# EasyEDA Pro project RC Receiver.epro

# Schematic Schematic
Board Name: Receiver; Create Date: 2025-03-04; Page Name: P1; Project Name: RC Receiver; Schematic Name: Schematic; Update Date: 2025-03-05; Company: MUS; Page Size: A4; Version: V1.0
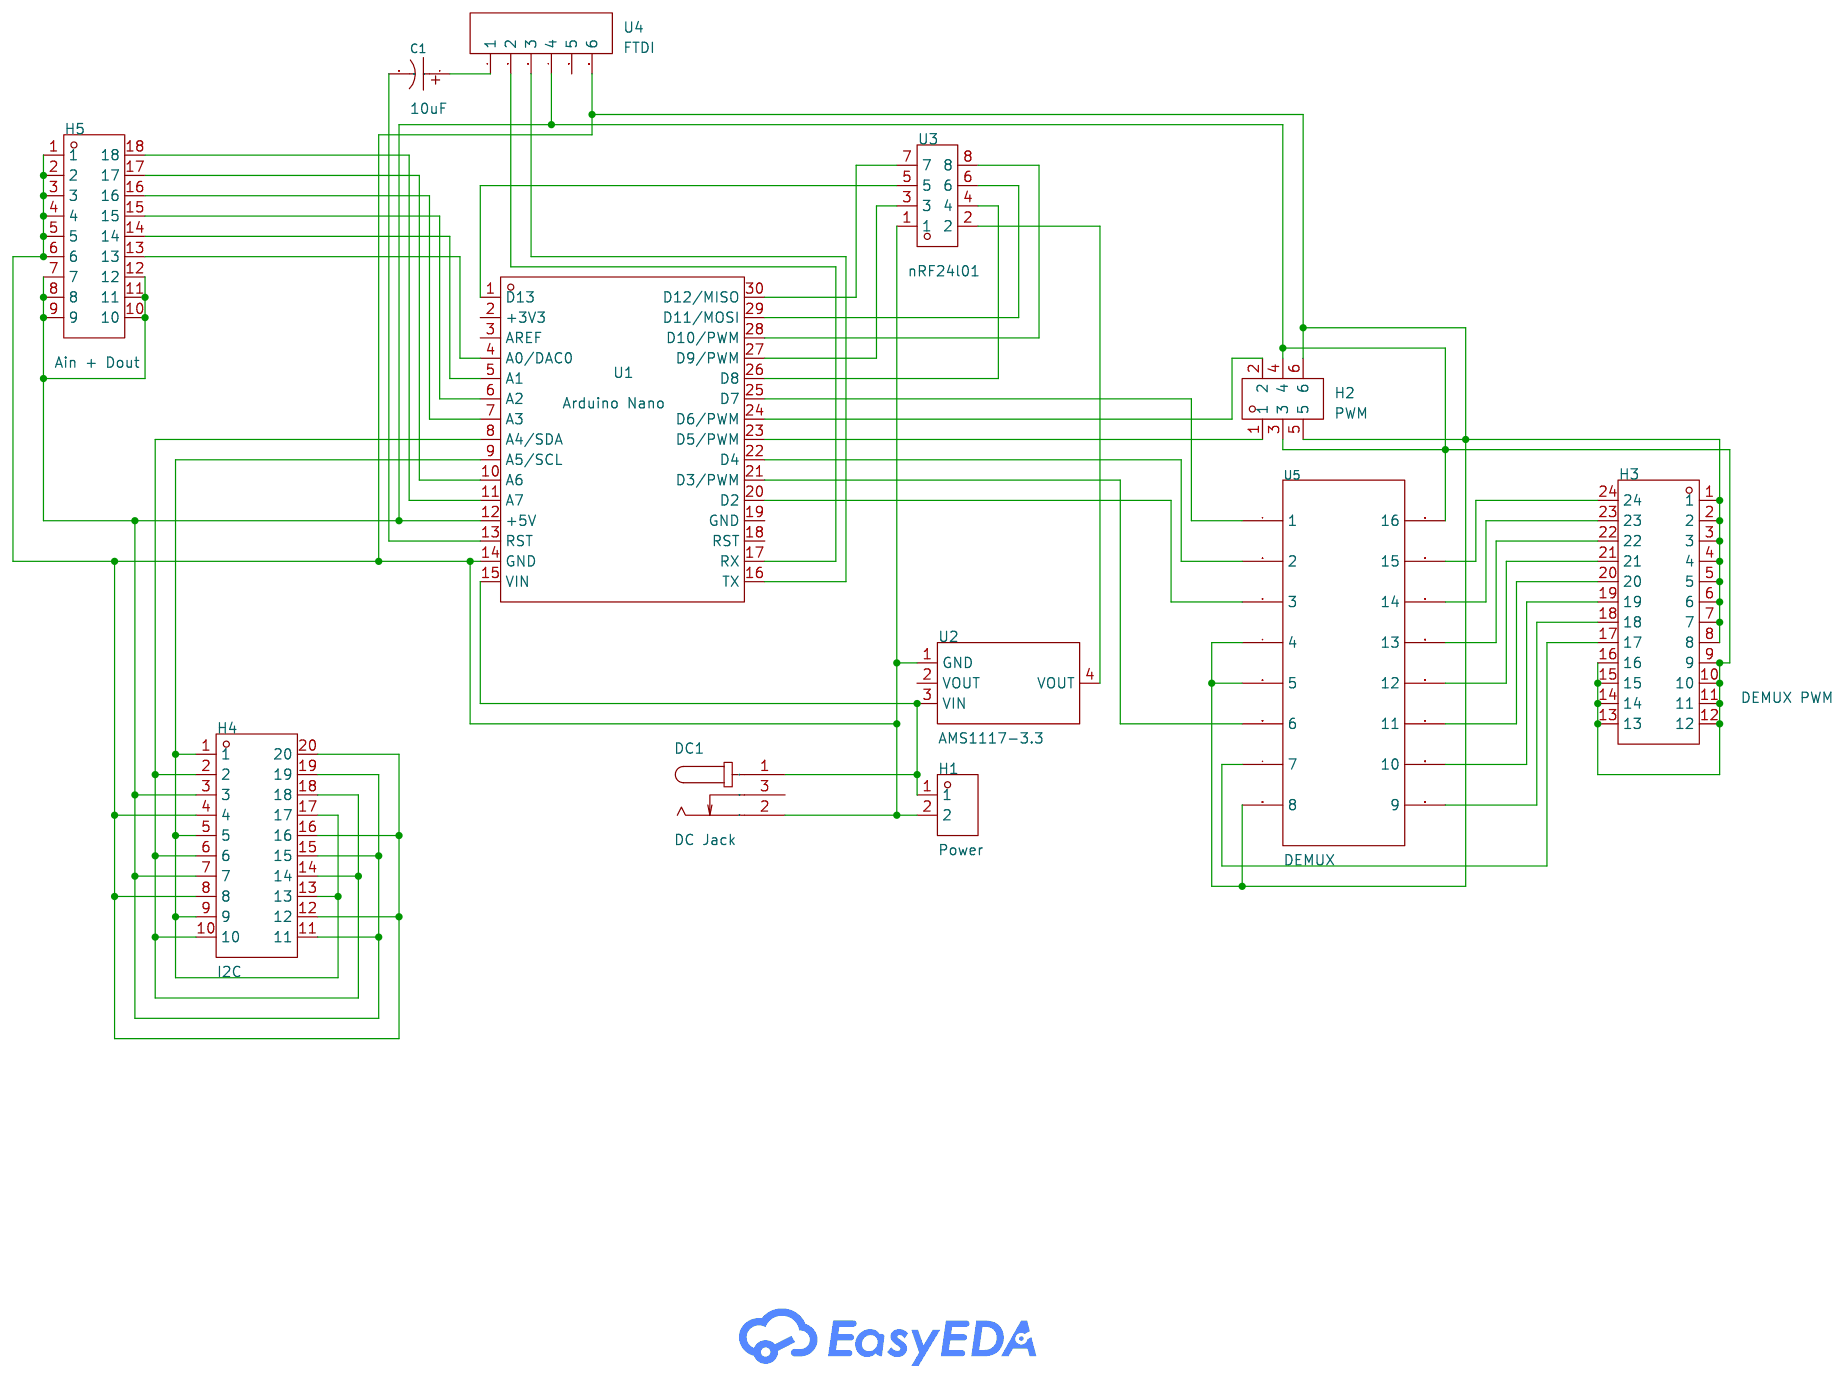
[diagram p0: schematic sheet]

## Parts
C1  10uF  [CAP-TH_BD5.0-P2.00-D0.8-FD]
DC1  DC Jack  [DC-IN-TH_DC-005-5A-2.0]
H1  Power  [HDR-TH_2P-P2.54-V-M_5]
H2  PWM  [HDR-TH_6P-P2.54-V-M-R2-C3-S2.54]
H3  DEMUX PWM  [HDR-TH_24P-P2.54-V-M-R3-C8-S2.54_1]
H4  I2C  [HDR-TH_20P-P2.54-V-M-R4-C5-S2.54]
H5  Ain + Dout  [CONN-TH_HX-PZ2.54-3X6P-ZZ]
U1  Arduino Nano  [MOD-TH_ABX00028]
U2  AMS1117-3.3  [SOT-223-3_L6.5-W3.4-P2.30-LS7.0-BR]
U3  nRF24l01  [HDR-TH_8P-P2.54-V-F-R2-C4-S2.54]
U4  FTDI  [HDR-TH_6P-P2.54-V-M-1]
U5  DEMUX  [DIP-16_L20.3-W10.2-P2.54-LS7.6-BL-2]

## Library data of the parts
C1 = RD1H106M05011PC: Capacitance: Tolerance:±20% Tolerance:±20% Rated Voltage: Ripple Current:- Equivalent Series Resistance(ESR):- Lead Spacing: φD: L: Lifetime @ Temp:1000hrs@105℃; LCSC Part Name: 10uF ±20% 50V; Supplier Part: C160624; Manufacturer: SAMWHA(三和); Supplier Footprint: 插件,D5xL11mm; JLCPCB Part Class: Extended Part; Datasheet: https://atta.szlcsc.com/upload/public/pdf/source/20171212/C160624_15130639695151177990.pdf; Supplier: LCSC; Tolerance: ±20%; Lifetime @ Temp: 1000hrs@105℃
DC1 = DC-005-5A-2.0: Connector Type:DC Power Receptacle Mounting Style:Bend insert Inside Contact Diameter:2mm Outside Contact Diameter:6.2mm Current Rating (Max):5A Voltage Rating (Max):24V Operating Temperature Range:-20℃~+70℃ Operating Temperature Range:-20℃~+70℃; LCSC Part Name: DC电源插座 内径:2mm 外径:6.2mm; Supplier Part: C381116; Manufacturer: XKB Connection(中国星坤); Supplier Footprint: 插件; JLCPCB Part Class: Extended Part; Datasheet: https://atta.szlcsc.com/upload/public/pdf/source/20211015/707A35F7AB6E89C57AAB641950105BB7.pdf; Supplier: LCSC; Connector Type: DC Power Receptacle; Mounting Style: Bend insert; Inside Contact Diameter: 2mm; Outside Contact Diameter: 6.2mm; Current Rating (Max): 5A; Voltage Rating (Max): 24V; Operating Temperature Range: -20℃~+70℃
H1 = PZ254-1-02-Z-C: Pin Structure:1x2P Pitch:2.54mm Row Spacing:- Circluar Pins/Square Pins:Circular Pins Mounting Type:Straight Number of Rows:Plugin Number of Pins:2P Current Rating (Max):3A Length of Mating Pin:4.13mm Insulation Height:3mm Length of End Connection Pin:3mm; LCSC Part Name: 1x2P 间距:2.54mm 圆针 直插; Supplier Part: C5156429; Manufacturer: HCTL(华灿天禄); Supplier Footprint: 插件,P=2.54mm; JLCPCB Part Class: Extended Part; Datasheet: https://atta.szlcsc.com/upload/public/pdf/source/20230609/791AB95BE9F63E00E86E05F9E750B3EF.pdf; Supplier: LCSC; Pin Structure: 1x2P; Pitch: 2.54mm; Circluar Pins/Square Pins: Circular Pins; Mounting Type: Straight; Number of Rows: Plugin; Number of Pins: 2P; Current Rating (Max): 3A; Length of Mating Pin: 4.13mm; Insulation Height: 3mm; Length of End Connection Pin: 3mm; Contact Plating: Gold; Operating Temperature Range: -40℃~+105℃; Soldering Temperature(Max): 260℃@10S; Color: Black
H2 = PZ254V-12-6P: Pin Structure:2x3P Pitch:2.54mm Row Spacing:2.54mm Circluar Pins/Square Pins:Square Pins Mounting Type:Straight Number of Rows:双排 Number of Pins:6P Current Rating (Max):- Voltage Rating (Max):- Length of Mating Pin:6mm Insulation Height:2.5mm Length of En; LCSC Part Name: 间距:2.54mm 2x3P 直插 方针; Supplier Part: C492420; Manufacturer: XFCN(兴飞); Supplier Footprint: 插件,P=2.54mm; JLCPCB Part Class: Extended Part; Datasheet: https://atta.szlcsc.com/upload/public/pdf/source/20200309/C492420_BAECB307B001054C09D200388220EAE6.pdf; Supplier: LCSC; Pin Structure: 2x3P; Pitch: 2.54mm; Row Spacing: 2.54mm; Circluar Pins/Square Pins: Square Pins; Mounting Type: Straight; Number of Rows: 双排; Number of Pins: 6P; Length of Mating Pin: 6mm; Insulation Height: 2.5mm; Length of End Connection Pin: 3mm; Operating Temperature Range: -40℃~+105℃; Color: Black
H3 = HX PZ2.54-3x8P ZZ: Pin Structure:3x8P Pitch:2.54mm Row Spacing:2.54mm Circluar Pins/Square Pins:Policy Mounting Type:Direct Insert Number of Rows:Triple row Number of Pins:24P Current Rating (Max):3A Voltage Rating (Max):- Length of Mating Pin:6mm Insulation Height:2.5mm Le; LCSC Part Name: 3x8P 间距:2.54mm 方针 直插; Supplier Part: C32713295; Manufacturer: hanxia(韩下); Supplier Footprint: 插件,P=2.54mm; JLCPCB Part Class: Extended Part; Datasheet: https://atta.szlcsc.com/upload/public/pdf/source/20240723/81BA62910452254F3F6A9430A78385C7.pdf; Supplier: LCSC; Pin Structure: 3x8P; Pitch: 2.54mm; Row Spacing: 2.54mm; Circluar Pins/Square Pins: Policy; Mounting Type: Direct Insert; Number of Rows: Triple row; Number of Pins: 24P; Current Rating (Max): 3A; Length of Mating Pin: 6mm; Insulation Height: 2.5mm; Length of End Connection Pin: 3mm; Contact Material: Brass; Contact Plating: Gold; Operating Temperature Range: -40℃~+105℃; Color: Black
H4 = HX PZ2.54-4x5P ZZ: Pin Structure:4x5P Pitch:2.54mm Row Spacing:2.54mm Circluar Pins/Square Pins:Policy Mounting Type:Direct Insert Number of Rows:Four rows Number of Pins:20P Current Rating (Max):3A Voltage Rating (Max):- Length of Mating Pin:6mm Insulation Height:2.5mm Len; LCSC Part Name: 4x5P 间距:2.54mm 方针 直插; Supplier Part: C32713299; Manufacturer: hanxia(韩下); Supplier Footprint: 插件,P=2.54mm; JLCPCB Part Class: Extended Part; Datasheet: https://atta.szlcsc.com/upload/public/pdf/source/20240723/6A176166D1A76A78CC2FA8FC287512BB.pdf; Supplier: LCSC; Pin Structure: 4x5P; Pitch: 2.54mm; Row Spacing: 2.54mm; Circluar Pins/Square Pins: Policy; Mounting Type: Direct Insert; Number of Rows: Four rows; Number of Pins: 20P; Current Rating (Max): 3A; Length of Mating Pin: 6mm; Insulation Height: 2.5mm; Length of End Connection Pin: 3mm; Contact Material: Brass; Contact Plating: Gold; Operating Temperature Range: -40℃~+105℃; Color: Black
H5 = HX PZ2.54-3x6P ZZ: Pin Structure:3x6P Pitch:2.54mm Row Spacing:2.54mm Circluar Pins/Square Pins:Policy Mounting Type:Direct Insert Number of Rows:Triple row Number of Pins:18P Current Rating (Max):3A Voltage Rating (Max):- Length of Mating Pin:6mm Insulation Height:2.5mm Le; LCSC Part Name: 3x6P 间距:2.54mm 方针 直插; Supplier Part: C32713293; Manufacturer: hanxia(韩下); Supplier Footprint: 插件,P=2.54mm; JLCPCB Part Class: Extended Part; Datasheet: https://atta.szlcsc.com/upload/public/pdf/source/20240723/B9E8CCE7746998ECA93891F2E834C7B0.pdf; Supplier: LCSC; Pin Structure: 3x6P; Pitch: 2.54mm; Row Spacing: 2.54mm; Circluar Pins/Square Pins: Policy; Mounting Type: Direct Insert; Number of Rows: Triple row; Number of Pins: 18P; Current Rating (Max): 3A; Length of Mating Pin: 6mm; Insulation Height: 2.5mm; Length of End Connection Pin: 3mm; Contact Material: Brass; Contact Plating: Gold; Operating Temperature Range: -40℃~+105℃; Color: Black
U1 = ABX00028: Supplier Part: C21303176; Manufacturer: arduino; Datasheet: https://atta.szlcsc.com/upload/public/pdf/source/20240516/DBE20BC6A27351D8B1B352A6E0678D57.pdf; Supplier: LCSC
U2 = AMS1117-3.3_C6186: Output Type:Fixed Voltage - Supply:- Output Voltage:3.3V Output Voltage:3.3V Output Current:1A Power Supply Rejection Ratio (PSRR):72dB@(120Hz) Voltage Dropout:1.3V@(800mA) standby current:- Noise:- Features:Overcurrent Protection(OCP)；Thermal Protection(; LCSC Part Name: 输出3.3V 1A; Supplier Part: C6186; Manufacturer: AMS; Supplier Footprint: SOT-223; JLCPCB Part Class: Basic Part; Datasheet: https://atta.szlcsc.com/upload/public/pdf/source/20180727/C6186_7A095716F0823C02F1997A905E26C086.pdf; Supplier: LCSC; Output Type: Fixed; Output Voltage: 3.3V; Output Current: 1A; Power Supply Rejection Ratio (PSRR): 72dB@(120Hz); Voltage Dropout: 1.3V@(800mA); Features: Overcurrent Protection(OCP)；Thermal Protection(TSD); Output Configuration: Positive electrode; Number of Outputs: 1
U3 = 2.54-2*4: Holes Structure:2x4P Pitch:2.54mm Row Spacing:2.54mm Circular Hole / Square Hole:Square Holes Mounting Type:Straight Number of Rows:双排 Number of Holes:8P Current Rating (Max):2.5A Voltage Rating (Max):- Holes Direction:Top Insulation Height:8.5mm Operatin; LCSC Part Name: 间距:2.54mm 2x4P 直插; Supplier Part: C2977588; Manufacturer: ZHOURI(洲日); Supplier Footprint: 插件,P=2.54mm; JLCPCB Part Class: Extended Part; Datasheet: https://atta.szlcsc.com/upload/public/pdf/source/20220328/363EB391BC0EB759CF231FC910753CBE.pdf; Supplier: LCSC; Holes Structure: 2x4P; Pitch: 2.54mm; Row Spacing: 2.54mm; Circular Hole / Square Hole: Square Holes; Mounting Type: Straight; Number of Rows: 双排; Number of Holes: 8P; Current Rating (Max): 2.5A; Holes Direction: Top; Insulation Height: 8.5mm; Operating Temperature Range: -40℃~+105℃
U4 = 2.54-1x6P直针: Pin Structure:1x6P Pitch:2.54mm Row Spacing:- Circluar Pins/Square Pins:Square Pins Mounting Type:Straight Number of Rows:Plugin Number of Pins:6P Current Rating (Max):3A Voltage Rating (Max):- Length of Mating Pin:- Insulation Height:- Contact Material:; LCSC Part Name: 间距:2.54mm 1x6P 直插 方针; Supplier Part: C37208; Manufacturer: BOOMELE(博穆精密); Supplier Footprint: 插件,P=2.54mm; JLCPCB Part Class: Extended Part; Supplier: LCSC; Pin Structure: 1x6P; Pitch: 2.54mm; Circluar Pins/Square Pins: Square Pins; Mounting Type: Straight; Number of Rows: Plugin; Number of Pins: 6P; Current Rating (Max): 3A; Operating Temperature Range: -40℃~+105℃; Color: Black
U5 = DS1009-16AT1NX-0A2: IC Type:DIP Pitch:2.54mm Row Spacing:7.62mm Number of Positions:16P Contact Plating:Tin; LCSC Part Name: 间距2.54mm P数:16P; Supplier Part: C72115; Manufacturer: CONNFLY; Supplier Footprint: DIP-16; JLCPCB Part Class: Extended Part; Datasheet: https://atta.szlcsc.com/upload/public/pdf/source/20160429/1461922462758.pdf; Supplier: LCSC; IC Type: DIP; Pitch: 2.54mm; Row Spacing: 7.62mm; Number of Positions: 16P; Contact Plating: Tin

## Nets
$1N448: U2.4(VOUT) U3.2
$1N454: U1.26(D8) U3.4
$1N460: U1.27(D9/PWM) U3.3
$1N467: U1.28(D10/PWM) U3.8
$1N474: U1.29(D11/MOSI) U3.6
$1N481: U1.30(D12/MISO) U3.7
$1N488: U1.1(D13) U3.5
$1N594: C1.1 U4.1
$1N598: C1.2 U1.13(RST)
$1N603: U1.17(RX) U4.2
$1N611: U1.16(TX) U4.3
$1N986: H2.1 U1.23(D5/PWM)
$1N990: H2.2 U1.24(D6/PWM)
$1N1510: DC1.1 H1.1 U1.15(VIN) U2.3(VIN)
$1N1788: H3.24 U5.15
$1N1794: H3.23 U5.14
$1N1801: H3.22 U5.13
$1N1808: H3.21 U5.12
$1N1815: H3.20 U5.11
$1N1822: H3.19 U5.10
$1N2143: H3.18 U5.9
$1N2149: H3.17 U5.7
$1N2262: U1.21(D3/PWM) U5.6
$1N2583: U1.25(D7) U5.1
$1N2589: U1.22(D4) U5.2
$1N2596: U1.20(D2) U5.3
$1N2700: H4.1 H4.5 H4.9 H4.13 H4.17 U1.9(A5/SCL)
$1N2705: H4.2 H4.6 H4.10 H4.14 H4.18 U1.8(A4/SDA)
$1N3343: H5.13 U1.4(A0/DAC0)
$1N3349: H5.14 U1.5(A1)
$1N3356: H5.15 U1.6(A2)
$1N3363: H5.16 U1.7(A3)
$1N3370: H5.17 U1.10(A6)
$1N3377: H5.18 U1.11(A7)
$1N3901: H2.3 H2.4 H3.9 H3.10 H3.11 H3.12 H3.13 H3.14 H3.15 H3.16 H4.3 H4.7 H4.11 H4.15 H4.19 H5.7 H5.8 H5.9 H5.10 H5.11 H5.12 U1.12(+5V) U4.4 U5.16
$1N3957: DC1.2 H1.2 H2.5 H2.6 H3.1 H3.2 H3.3 H3.4 H3.5 H3.6 H3.7 H3.8 H4.4 H4.8 H4.12 H4.16 H4.20 H5.1 H5.2 H5.3 H5.4 H5.5 H5.6 U1.14(GND) U2.1(GND) U3.1 U4.6 U5.4 U5.5 U5.8

Not connected (* = marked no-connect by the designer): DC1 3; U1 2(+3V3) 3(AREF) 18(RST) 19(GND); U2 2(VOUT); U4 5

# Board PCB
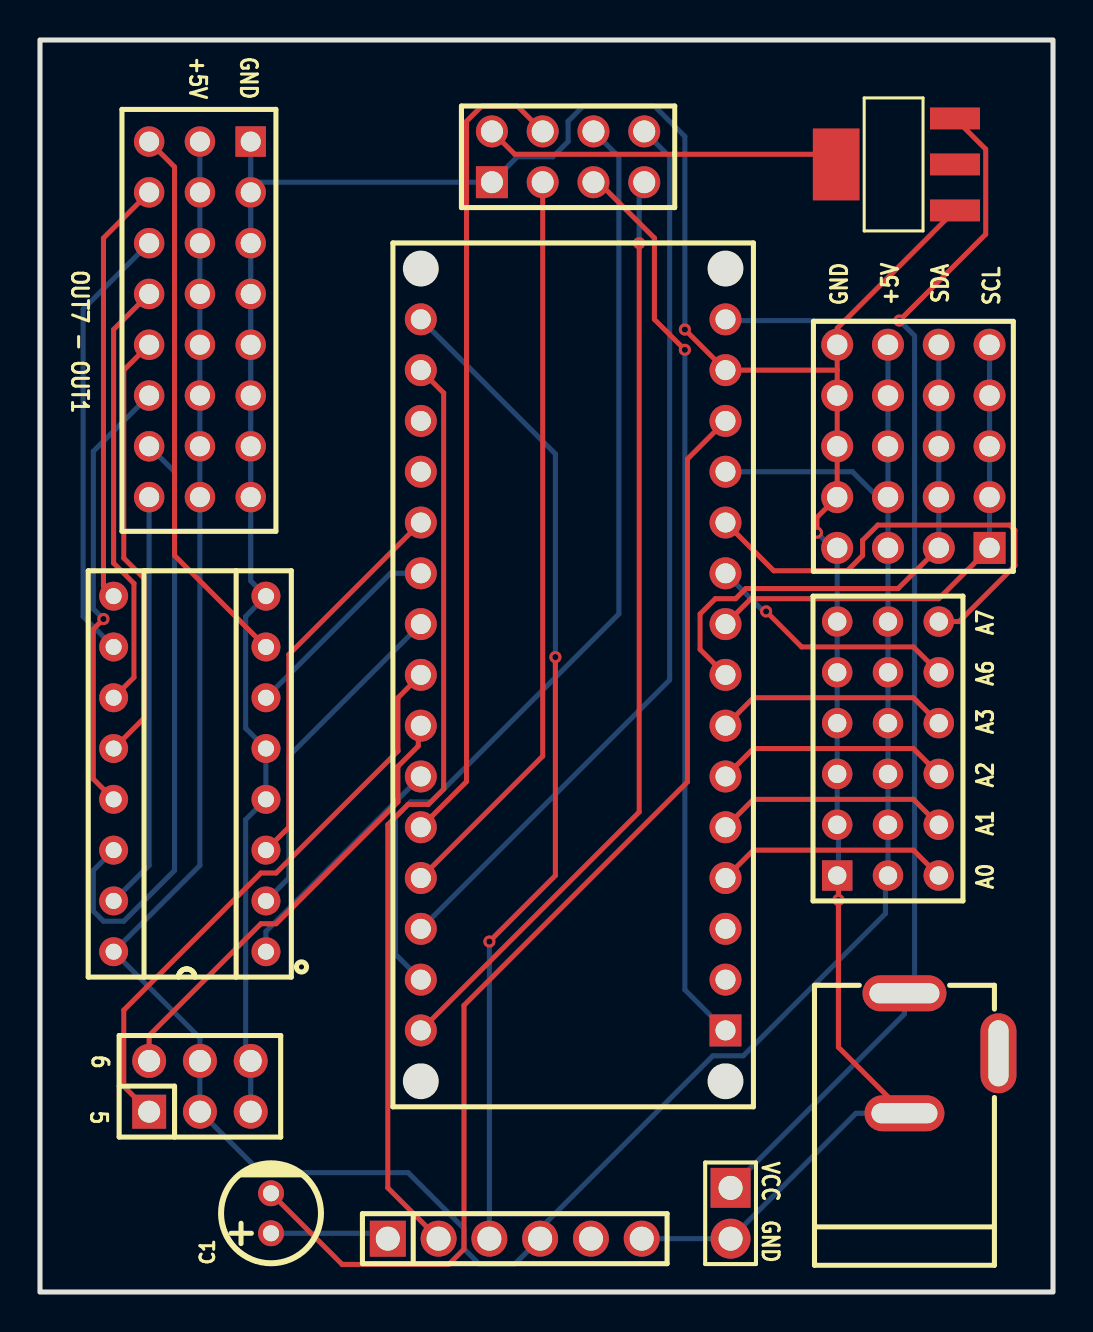
[diagram p1: board, top side]
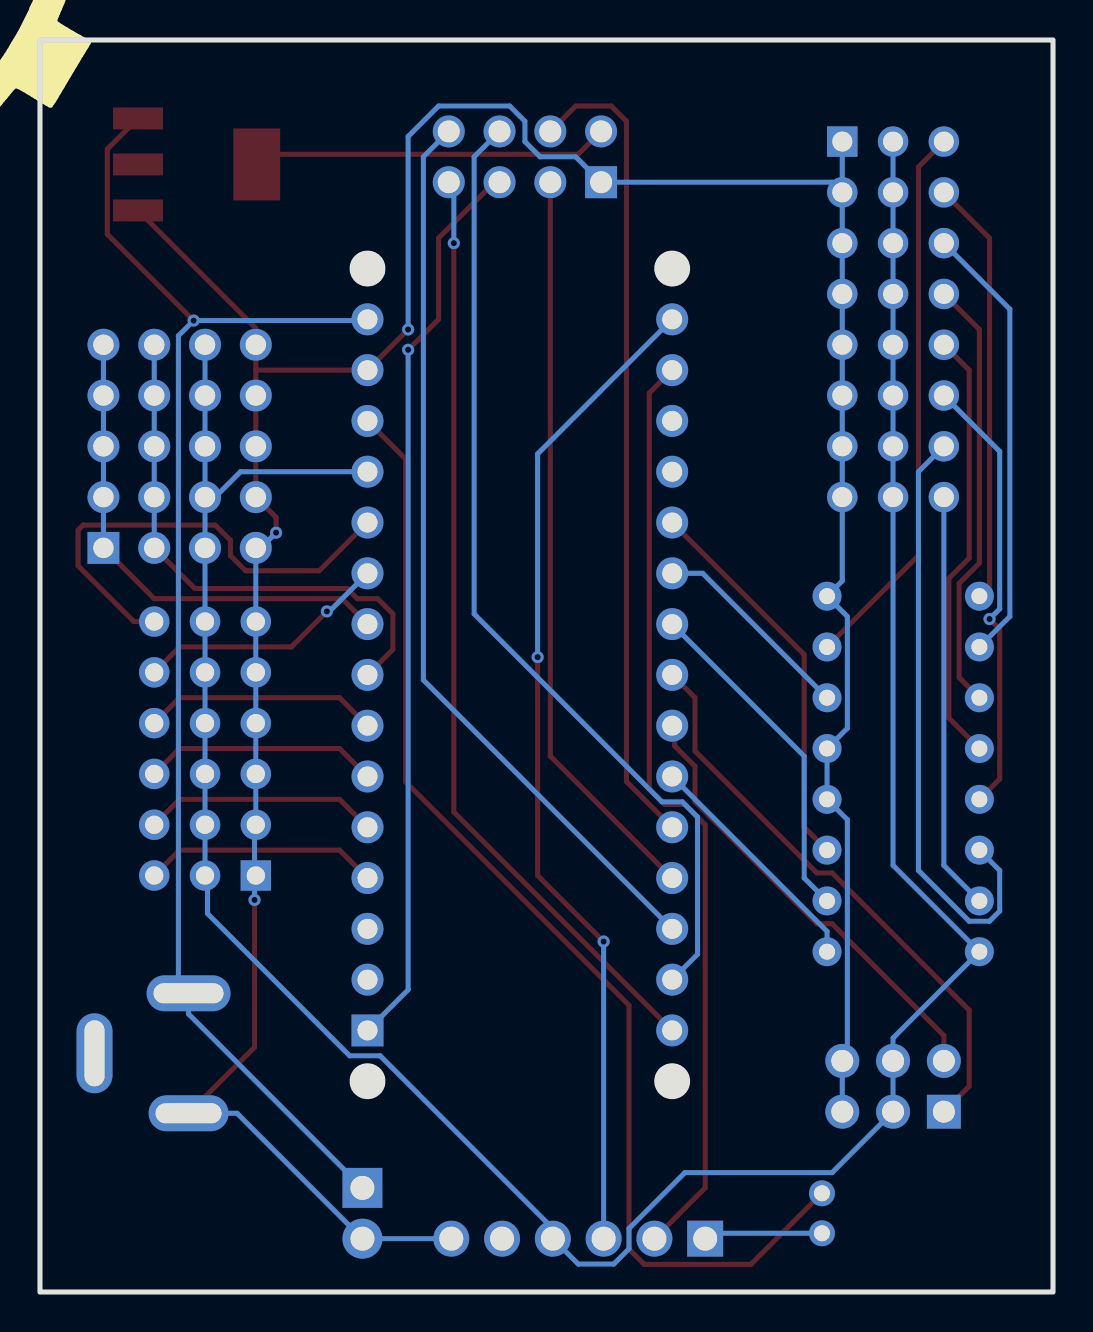
[diagram p2: board, bottom side, seen from below]

Outline 50.67 x 62.61 mm; copper layers: Top Layer, Bottom Layer. Coordinates in mm from the lower left corner of the outline.
Outline path: rectangle 0,62.61 50.67,0
Stack: Top Layer 0.035mm / Dielectric1 1.51mm FR4 er 4.5 / Bottom Layer 0.035mm

## Design rules (mm)
template: JLCPCB Capability(Two Layers Board)
spacing copperThickness1oz (default): track to track 0.102, other pairs 0.152 to 0.3
spacing copperThickness2oz: track to track 0.203, other pairs 0.152 to 0.3
track width copperThickness1oz (default): min 0.127, default 0.254, max 2.54
track width copperThickness2oz: min 0.203, default 0.254, max 2.54
differential pair differentialPair (default): width min 0.127, default 0.254, max 2.54; gap min 0.152, default 0.152
via viaSize (default): diameter min 0.5, default 0.61, max 10; hole min 0.3, default 0.305, max 6.3

## Placement (name value [footprint] x y rotation side)
C1  10uF  [CAP-TH_BD5.0-P2.00-D0.8-FD]  11.56 3.94 90 top
DC1  DC Jack  [DC-IN-TH_DC-005-5A-2.0]  45.59 11.94 90 top
H1  Power  [HDR-TH_2P-P2.54-V-M_5]  34.54 3.94 270 top
H2  PWM  [HDR-TH_6P-P2.54-V-M-R2-C3-S2.54]  8 10.29 0 top
H3  DEMUX PWM  [HDR-TH_24P-P2.54-V-M-R3-C8-S2.54_1]  8 48.64 270 top
H4  I2C  [HDR-TH_20P-P2.54-V-M-R4-C5-S2.54]  43.69 42.29 90 top
H5  Ain + Dout  [CONN-TH_HX-PZ2.54-3X6P-ZZ]  42.42 27.18 90 top
U1  Arduino Nano  [MOD-TH_ABX00028]  26.67 30.86 180 top
U2  AMS1117-3.3  [SOT-223-3_L6.5-W3.4-P2.30-LS7.0-BR]  42.8 56.39 0 top
U3  nRF24l01  [HDR-TH_8P-P2.54-V-F-R2-C4-S2.54]  26.42 56.77 0 top
U4  FTDI  [HDR-TH_6P-P2.54-V-M-1]  23.75 2.67 0 top
U5  DEMUX  [DIP-16_L20.3-W10.2-P2.54-LS7.6-BL-2]  7.49 25.91 90 top

## Footprints (pads in the part's own frame, mm; a bottom-side part is the same pattern mirrored in y, then rotated)
CAP-TH_BD5.0-P2.00-D0.8-FD
  round 1.3 hole 0.8: 1(-1,0) 2(1,0)
CONN-TH_HX-PZ2.54-3X6P-ZZ
  rect 1.524x1.524 hole 0.914: 1(-6.35,2.54)
  round 1.524 hole 0.914: 2(-3.81,2.54) 3(-1.27,2.54) 4(1.27,2.54) 5(3.81,2.54) 6(6.35,2.54) 7(-6.35,0) 8(-3.81,0) 9(-1.27,0) 10(1.27,0) 11(3.81,0) 12(6.35,0) 13(-6.35,-2.54) 14(-3.81,-2.54) 15(-1.27,-2.54) 16(1.27,-2.54) 17(3.81,-2.54) 18(6.35,-2.54)
DC-IN-TH_DC-005-5A-2.0
  oval 1.8x4.2 hole 1x3.5: 1(3,2.352)
  oval 1.8x4 hole 1x3.3: 2(-3,2.352)
  oval 4x1.8 hole 3.3x1: 3(-0.001,-2.352)
DIP-16_L20.3-W10.2-P2.54-LS7.6-BL-2
  round 1.45 hole 0.8: 1(-8.89,-3.81) 2(-6.35,-3.81) 3(-3.81,-3.81) 4(-1.27,-3.81) 5(1.27,-3.81) 6(3.81,-3.81) 7(6.35,-3.81) 8(8.89,-3.81) 9(8.89,3.81) 10(6.35,3.81) 11(3.81,3.81) 12(1.27,3.81) 13(-1.27,3.81) 14(-3.81,3.81) 15(-6.35,3.81) 16(-8.89,3.81)
HDR-TH_2P-P2.54-V-M_5
  rect 2x2 hole 1.2: 1(-1.27,0)
  round 2 hole 1.2: 2(1.27,0)
HDR-TH_6P-P2.54-V-M-1
  rect 1.8x1.8 hole 1.2: 1(-6.35,0)
  round 1.8 hole 1.2: 2(-3.81,0) 3(-1.27,0) 4(1.27,0) 5(3.81,0) 6(6.35,0)
HDR-TH_6P-P2.54-V-M-R2-C3-S2.54
  rect 1.7x1.7 hole 1.1: 1(-2.54,-1.27)
  round 1.7 hole 1.1: 2(-2.54,1.27) 3(0,-1.27) 4(0,1.27) 5(2.54,-1.27) 6(2.54,1.27)
HDR-TH_8P-P2.54-V-F-R2-C4-S2.54
  rect 1.6x1.6 hole 1.1: 1(-3.81,-1.27)
  round 1.6 hole 1.1: 2(-3.81,1.27) 3(-1.27,-1.27) 4(-1.27,1.27) 5(1.27,-1.27) 6(1.27,1.27) 7(3.81,-1.27) 8(3.81,1.27)
HDR-TH_20P-P2.54-V-M-R4-C5-S2.54
  rect 1.6x1.6 hole 1.02: 1(-5.08,-3.81)
  round 1.6 hole 1.02: 2(-5.08,-1.27) 3(-5.08,1.27) 4(-5.08,3.81) 5(-2.54,-3.81) 6(-2.54,-1.27) 7(-2.54,1.27) 8(-2.54,3.81) 9(0,-3.81) 10(0,-1.27) 11(0,1.27) 12(0,3.81) 13(2.54,-3.81) 14(2.54,-1.27) 15(2.54,1.27) 16(2.54,3.81) 17(5.08,-3.81) 18(5.08,-1.27) 19(5.08,1.27) 20(5.08,3.81)
HDR-TH_24P-P2.54-V-M-R3-C8-S2.54_1
  rect 1.524x1.524 hole 1: 1(-8.89,2.54)
  round 1.524 hole 1: 2(-6.35,2.54) 3(-3.81,2.54) 4(-1.27,2.54) 5(1.27,2.54) 6(3.81,2.54) 7(6.35,2.54) 8(8.89,2.54) 9(-8.89,0) 10(-6.35,0) 11(-3.81,0) 12(-1.27,0) 13(1.27,0) 14(3.81,0) 15(6.35,0) 16(8.89,0) 17(-8.89,-2.54) 18(-6.35,-2.54) 19(-3.81,-2.54) 20(-1.27,-2.54) 21(1.27,-2.54) 22(3.81,-2.54) 23(6.35,-2.54) 24(8.89,-2.54)
MOD-TH_ABX00028
  rect 1.6x1.6 hole 1: 1(-7.62,17.78)
  round 1.6 hole 1: 2(-7.62,15.24) 3(-7.62,12.7) 4(-7.62,10.16) 5(-7.62,7.62) 6(-7.62,5.08) 7(-7.62,2.54) 8(-7.62,0) 9(-7.62,-2.54) 10(-7.62,-5.08) 11(-7.62,-7.62) 12(-7.62,-10.16) 13(-7.62,-12.7) 14(-7.62,-15.24) 15(-7.62,-17.78) 16(7.62,-17.78) 17(7.62,-15.24) 18(7.62,-12.7) 19(7.62,-10.16) 20(7.62,-7.62) 21(7.62,-5.08) 22(7.62,-2.54) 23(7.62,0) 24(7.62,2.54) 25(7.62,5.08) 26(7.62,7.62) 27(7.62,10.16) 28(7.62,12.7) 29(7.62,15.24) 30(7.62,17.78)
SOT-223-3_L6.5-W3.4-P2.30-LS7.0-BR
  rect 2.5x1.1 smd: 1(2.97,-2.3) 2(2.97,0) 3(2.97,2.3)
  rect 2.34x3.6 smd: 4(-2.97,0)

## Nets
As in the schematic.

Pads without a net: DC1 3; U1 2 3 18 19; U2 2; U4 5

## Via types
v1: diameter 0.61, hole 0.305, Top Layer to Bottom Layer, 10 vias

## Routing (per net, layer and track width the routed paths; a pad name or vN(x,y) marks a point on that pad's centre or on a via; arc(x,y) is an arc through that point)
$1N448: length 17.9
  Top Layer w0.254: U2.4 39.32,56.9 23.75,56.9 U3.2
$1N454: length 40.9
  Top Layer w0.254: U1.26 21.34,25.53 21.34,58.55 22.1,59.31 23.88,59.31 U3.4
$1N460: length 37.3
  Top Layer w0.254: 19.05,20.7 25.15,26.8 U3.3
$1N467: length 45.6
  Bottom Layer w0.254: U3.8 31.5,56.77 31.5,30.61 U1.28
$1N474: length 48.7
  Bottom Layer w0.254: 19.05,15.62 17.78,16.89 17.78,23.75 18.54,24.51 19.56,24.51 28.96,33.91 28.96,56.77 27.69,58.04
$1N481: length 47
  Top Layer w0.254: v1(29.97,52.45) 29.97,24 U1.30
  Bottom Layer w0.254: v1(29.97,52.45) 29.97,55.25 U3.7
$1N488: length 45.3
  Top Layer w0.254: 27.69,55.5 27.94,55.5 30.73,52.7 30.73,48.64 v1(32.26,47.12)
  Bottom Layer w0.254: U1.1 32.26,15.11 v1(32.26,47.12)
$1N594: length 6
  Bottom Layer w0.254: C1.1 17.13,2.94 U4.1
$1N598: length 58.3
  Top Layer w0.254: C1.2 15.11,1.38 20.45,1.38 21.21,2.14 21.21,14.33 32.39,25.51 32.39,41.66 U1.13
$1N603: length 46.7
  Top Layer w0.254: U1.17 20.19,44.96 20.19,25.15 19.43,24.38 18.42,24.38 17.4,23.37 17.4,5.21 U4.2
$1N611: length 50.1
  Top Layer w0.254: v1(22.48,17.53) 25.78,20.83 v1(25.78,31.75)
  Bottom Layer w0.254: v1(22.48,17.53) U4.3 ; v1(25.78,31.75) 25.78,41.91 U1.16
$1N986: length 29
  Top Layer w0.254: H2.1 4.19,10.29 4.19,14.1 11.05,20.95 11.81,20.95 17.91,27.05 17.91,29.72 U1.23
$1N990: length 22.8
  Top Layer w0.254: 5.46,11.56 5.46,12.83 11.05,18.42 11.81,18.42 17.91,24.51 17.91,26.29 18.92,27.31 18.92,28.19 U1.24
$1N1510: length 68.8
  Top Layer w0.254: v1(42.99,48.58) 47.31,52.9 47.31,57.15 U2.3
  Bottom Layer w0.254: U1.15 34.35,48.58 v1(42.99,48.58) 43.75,47.82 43.75,15.45 DC1.1 43.24,13.9 H1.1
$1N1788: length 20.9
  Bottom Layer w0.254: H3.24 5.46,21.34 U5.15
$1N1794: length 30.5
  Bottom Layer w0.254: H3.23 6.73,41.02 6.73,21.08 4.19,18.54 3.17,18.54 2.67,19.05 2.67,21.08 U5.14
$1N1801: length 22.2
  Top Layer w0.254: v1(3.17,33.66) 2.67,33.15 2.67,25.65 U5.13
  Bottom Layer w0.254: H3.22 2.67,42.04 2.67,34.16 v1(3.17,33.66)
$1N1808: length 21.8
  Top Layer w0.254: H3.21 4.19,46.1 4.19,36.7 5.21,35.69 5.21,28.7 U5.12
$1N1815: length 21.8
  Top Layer w0.254: U5.11 4.7,30.73 4.7,35.43 3.68,36.45 3.68,48.13 H3.20
$1N1822: length 22.2
  Bottom Layer w0.254: U5.10 2.16,33.78 2.16,49.15 H3.19
$1N2143: length 21.4
  Top Layer w0.254: U5.9 3.17,35.31 3.17,52.7 H3.18
$1N2149: length 27.7
  Top Layer w0.254: U5.7 6.73,36.83 6.73,56.26 H3.17
$1N2262: length 10.3
  Bottom Layer w0.254: U5.6 17.53,35.94 U1.21
$1N2583: length 12
  Bottom Layer w0.254: U5.1 11.3,18.03 U1.25
$1N2589: length 17.1
  Bottom Layer w0.254: 19.05,33.4 12.45,26.8 12.45,20.7 U5.2
$1N2596: length 19.6
  Top Layer w0.254: U5.3 12.45,23.24 12.45,31.88 19.05,38.48
$1N2700: length 24.9
  Top Layer w0.254: H4.1 44.96,34.67 35.56,34.67 34.29,33.4
  Bottom Layer w0.254: H4.1 H4.9 H4.13 H4.17
$1N2705: length 27
  Top Layer w0.254: U1.8 33.02,32.13 33.02,33.91 33.78,34.67 34.8,34.67 35.31,35.18 42.93,35.18 H4.2
  Bottom Layer w0.254: H4.2 H4.10 H4.14 H4.18
$1N3343: length 11.8
  Top Layer w0.254: 34.29,20.7 35.69,22.1 43.69,22.1 H5.13
$1N3349: length 11.8
  Top Layer w0.254: U1.5 35.69,24.64 43.69,24.64 H5.14
$1N3356: length 11.8
  Top Layer w0.254: U1.6 35.69,27.18 43.69,27.18 H5.15
$1N3363: length 11.8
  Top Layer w0.254: H5.16 43.69,29.72 35.69,29.72 U1.7
$1N3370: length 12.7
  Top Layer w0.254: v1(36.32,34.04) 38.1,32.26 43.69,32.26 H5.17
  Bottom Layer w0.254: v1(36.32,34.04) 36.2,34.04 U1.10
$1N3377: length 23.7
  Top Layer w0.254: H5.18 45.97,33.53 48.77,36.32 48.77,38.1 48.51,38.35 41.91,38.35 41.15,37.59 41.15,36.83 40.39,36.07 36.7,36.07 34.29,38.48
$1N3901: length 135.1
  Bottom Layer w0.254: U1.12 40.64,41.02 42.42,39.24 ; H3.9 H3.10 H3.11 H3.12 H3.13 H3.14 H3.15 H3.16 8,21.34 U5.16 8,12.7 H2.3 11.05,5.97 18.42,5.97 21.21,3.18 21.21,2.16 21.97,1.4 23.75,1.4 U4.4 25.02,3.18 33.65,11.81 35.18,11.81 42.29,18.92 42.29,20.7 H5.7 H5.8 H5.9 H5.10 H5.11 H5.12 H4.3 42.42,39.24 ; 42.42,39.24 H4.11 H4.15 H4.19
$1N3957: length 160
  Top Layer w0.254: U2.1 39.88,48.2 H4.20 39.88,46.1 ; v1(38.86,37.97) 38.86,38.73 39.88,39.75 H4.12 H4.16 39.88,46.1 ; H5.1 39.94,20.77 v1(39.94,19.61) 39.94,12.24 DC1.2 ; 39.88,46.1 U1.14 v1(32.26,48.13)
  Bottom Layer w0.254: v1(32.26,48.13) 32.26,57.78 30.73,59.31 27.18,59.31 26.42,58.55 26.42,57.53 25.65,56.77 23.88,56.77 U3.1 11.05,55.5 H3.2 ; v1(39.94,19.61) 39.94,23.31 H5.2 H5.3 H5.4 H5.5 H5.6 H4.4 39.62,37.21 v1(38.86,37.97) ; DC1.2 40.82,8.94 H1.2 U4.6 ; H3.2 H3.3 H3.4 H3.5 H3.6 H3.7 H3.8 10.54,35.56 U5.8 10.29,33.78 10.29,28.19 U5.5 U5.4 10.29,23.62 10.29,11.81 10.54,11.56 H2.5 ; H3.2 H3.1

## Text on the board
Top Silkscreen Layer: GND | +5V | SDA | A7 | A6 | A3 | A2 | A1 | A0 | SCL | OUT7 - OUT1 | 5 | 6 | VCC
